# EAGLE schematic NSE2022 Electro_ESPtest ver.1 (EAGLE 9.6.2)
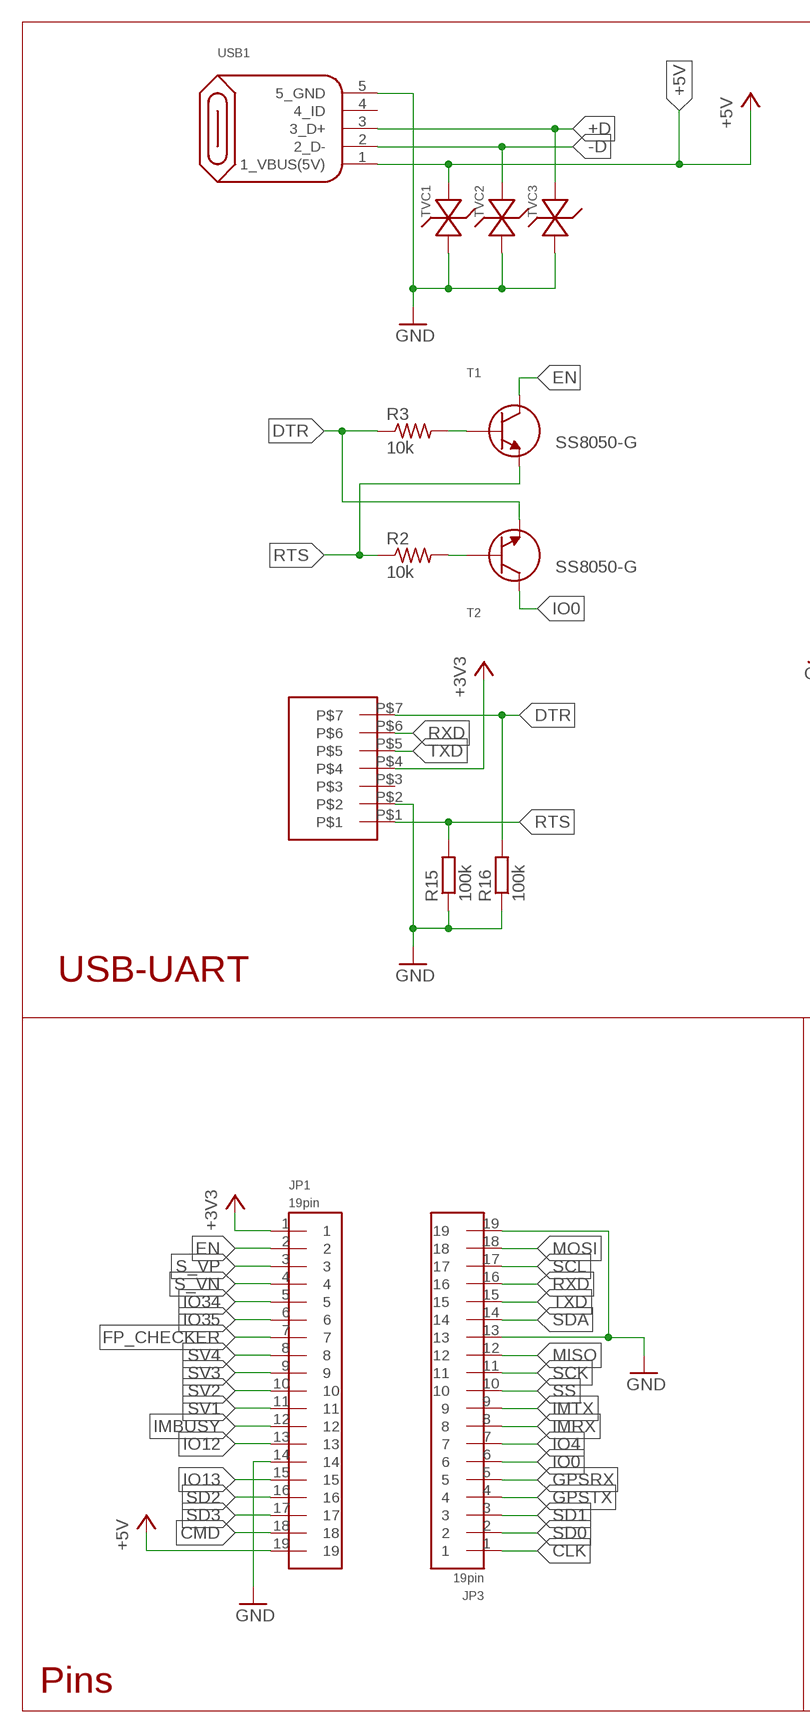
[diagram p0: schematic, sheet 1, part 1 of 2]
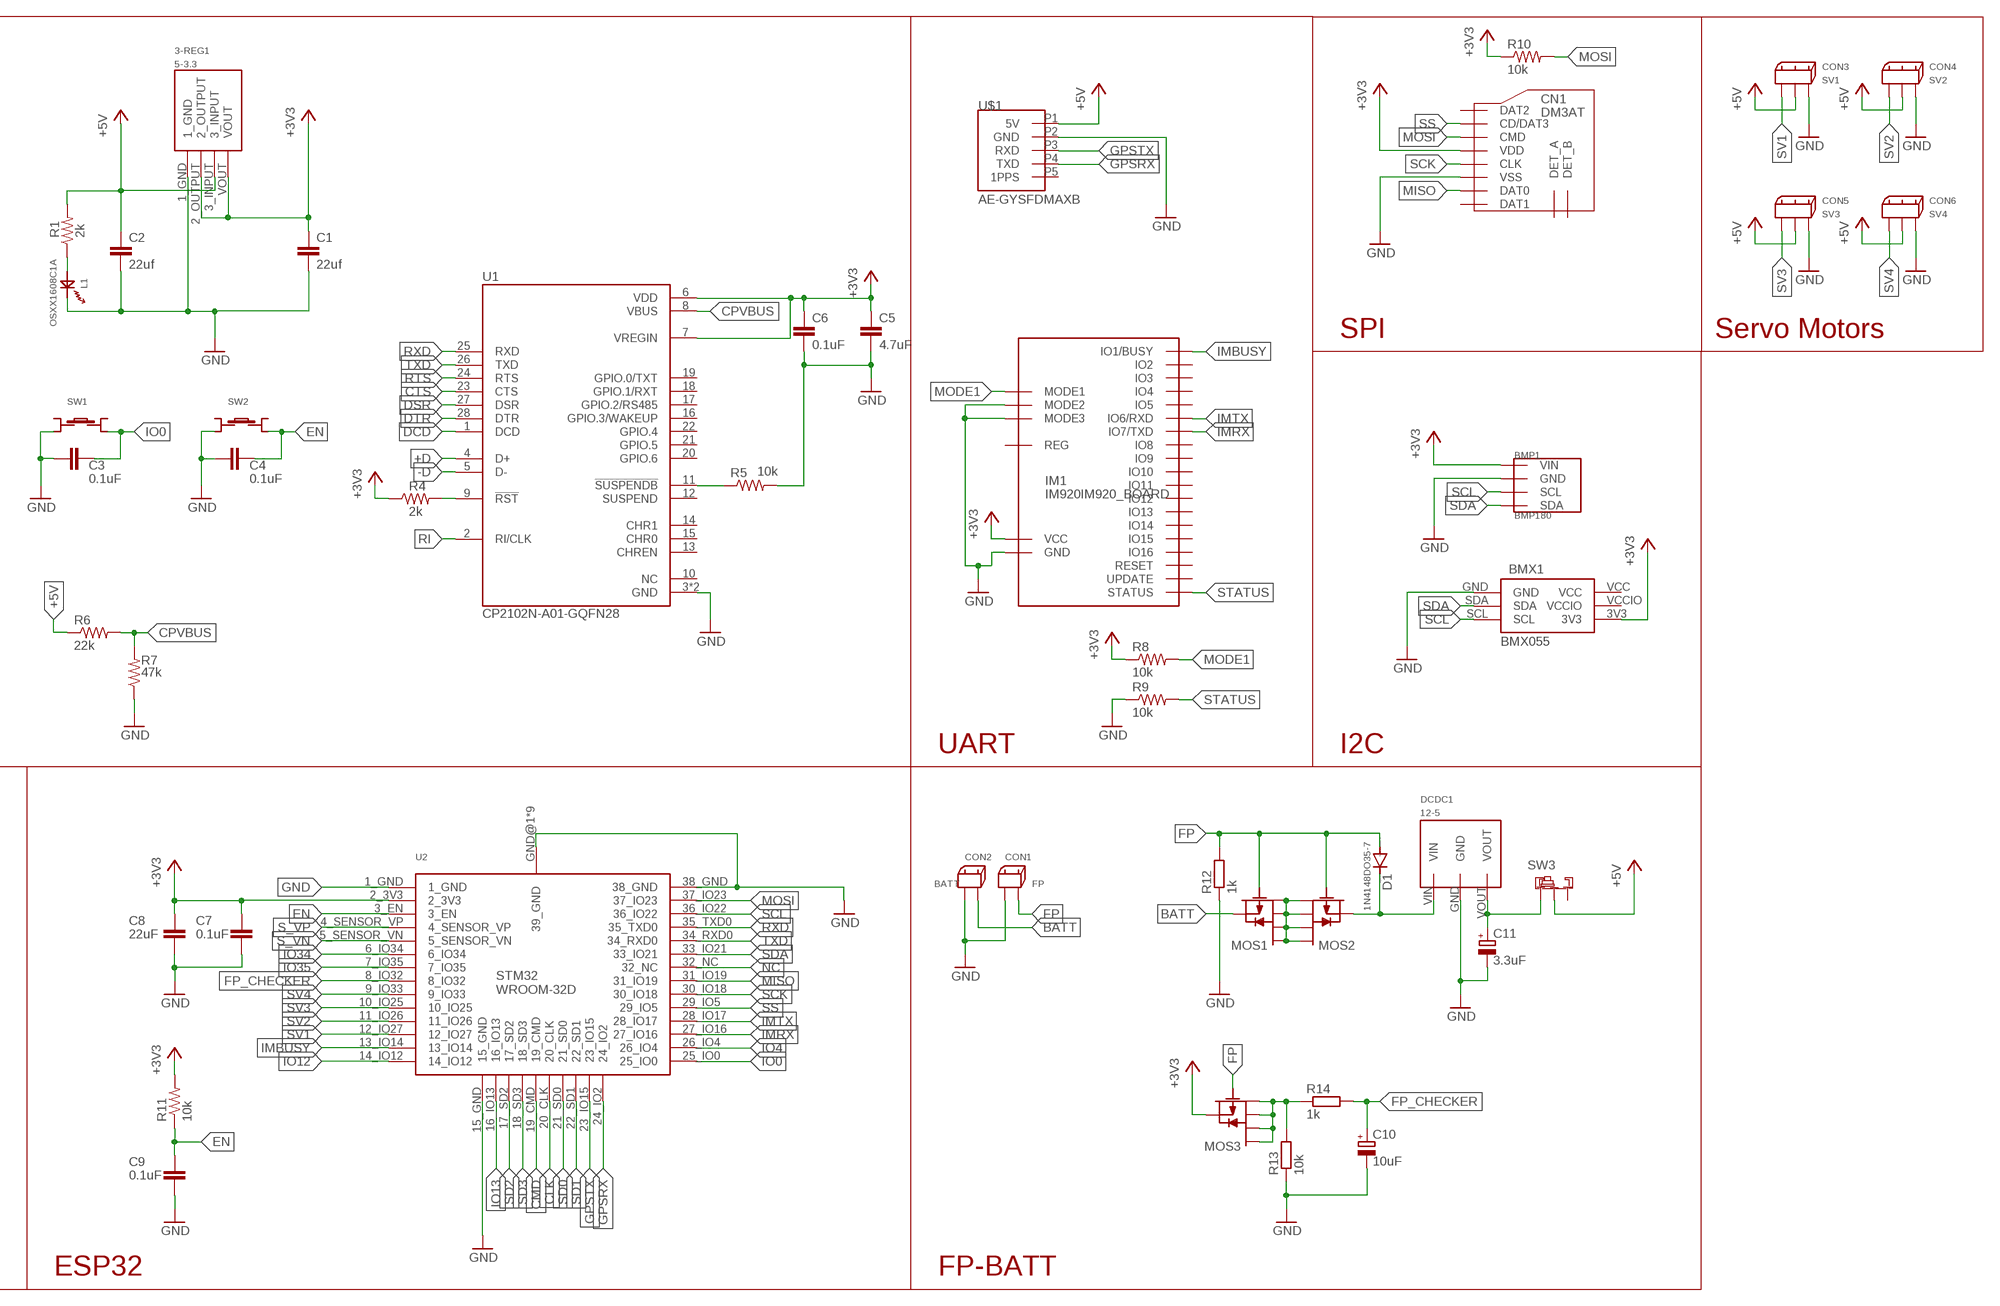
[diagram p1: schematic, sheet 1, part 2 of 2]

## Parts
3-REG1  5-3.3  AZ1117CH-3.3TRG1  [AZ1117CH-3.3TRG1]
BMP1  BMP180  [GY-68]
BMX1  BMX055  [BMX055]
C1  22uf  C-EUC0603  [C0603]
C2  22uf  C-EUC0603  [C0603]
C3  0.1uF  C-EUC0603  [C0603]
C4  0.1uF  C-EUC0603  [C0603]
C5  4.7uF  C-EUC0402  [C0402]
C6  0.1uF  C-EUC0603  [C0603]
C7  0.1uF  C-EUC0603  [C0603]
C8  22uF  C-EUC0603  [C0603]
C9  0.1uF  C-EUC0603  [C0603]
C10  10uF  CPOL-EUE2.5-5  [E2,5-5]
C11  3.3uF  CPOL-EUE2.5-5  [E2,5-5]
CN1  DM3AT  [DM3AT]
CON1  FP  2.5_MINI-SPOX_2PIN  [2.5_MINI-SPOX_2PIN]
CON2  BATT  2.5_MINI-SPOX_2PIN  [2.5_MINI-SPOX_2PIN]
CON3  SV1  2.5_MINI-SPOX_3PIN  [2.5_MINI-SPOX_3PIN]
CON4  SV2  2.5_MINI-SPOX_3PIN  [2.5_MINI-SPOX_3PIN]
CON5  SV3  2.5_MINI-SPOX_3PIN  [2.5_MINI-SPOX_3PIN]
CON6  SV4  2.5_MINI-SPOX_3PIN  [2.5_MINI-SPOX_3PIN]
D1  1N4148DO35-7  [DO35-7]
DCDC1  12-5  5V1A_M78AR05-1  [5V1A_M78AR05-1]
IM1  IM920IM920_BOARD  [IM920_BOARD]
JP1  19pin  19_2.54  [19_2.54]
JP2  7pin  7_2.54  [7_2.54]
JP3  19pin  19_2.54  [19_2.54]
L1  OSXX1608C1A  [OSXX1608C1A]
MOS1  PCH_SSM6J808R  [SSM6J808R]
MOS2  PCH_SSM6J808R  [SSM6J808R]
MOS3  PCH_SSM6J808R  [SSM6J808R]
R1  2k  R-US_R0201  [R0201]
R2  10k  R-US_R0201  [R0201]
R3  10k  R-US_R0201  [R0201]
R4  2k  R-US_R0201  [R0201]
R5  10k  R-US_R0201  [R0201]
R6  22k  R-US_R0201  [R0201]
R7  47k  R-US_R0201  [R0201]
R8  10k  R-US_R0201  [R0201]
R9  10k  R-US_R0201  [R0201]
R10  10k  R-US_R0201  [R0201]
R11  10k  R-US_R0201  [R0201]
R12  1k  R-EU_0207/10  [0207/10]
R13  10k  R-EU_0207/10  [0207/10]
R14  1k  R-EU_0207/10  [0207/10]
R15  100k  R-EU_0207/10  [0207/10]
R16  100k  R-EU_0207/10  [0207/10]
SW1  TS-06104  [TS-06104]
SW2  TS-06104  [TS-06104]
SW3  SRIDE_SWITCH  [SRIDE_SWITCH]
T1  NPN_SS8050-G  [NPN_SS8050-G]
T2  NPN_SS8050-G  [NPN_SS8050-G]
TVC1  ESD5484FCT5G  [ESD5484FCT5G]
TVC2  ESD5484FCT5G  [ESD5484FCT5G]
TVC3  ESD5484FCT5G  [ESD5484FCT5G]
U1  CP2102N-A01-GQFN28  [QFN50P500X500X80-29N]
U2  ESP32-WROOM-32D  [ESP32-WROOM-32D]
U$1  AE-GYSFDMAXB  [AE-GYSFDMAXB]
USB1  MICRO-B_ZX62R-B-5P  [MICRO-B_ZX62R-B-5P]

## Nets
+3V3 [esp]: 3-REG1.2_OUTPUT 3-REG1.VOUT BMP1.P1(VIN) BMX1.3V3 C1.1 C5.1 C6.1 C7.1 C8.1 CN1.VDD IM1.IO23(VCC) JP1.1 JP2.P$4 MOS3.S R4.1 R8.1 R10.1 R11.2 U1.6(VDD) U1.7(VREGIN) U2.2_3V3
+5V [esp]: 3-REG1.3_INPUT C2.1 CON3.2 CON4.2 CON5.2 CON6.2 JP1.19 R1.2 R6.1 SW3.LR TVC1.2_AN U$1.P1(5V) USB1.1(1_VBUS(5V))
+D [esp]: TVC3.2_AN U1.4(D+) USB1.3(3_D+)
-D [esp]: TVC2.2_AN U1.5(D-) USB1.2(2_D-)
BATT: CON2.2 MOS1.S
CLK [esp]: JP3.1 U2.20_CLK
CMD [esp]: JP1.18 U2.19_CMD
CPVBUS [esp]: R6.2 R7.2 U1.8(VBUS)
CTS [esp]: U1.23(CTS)
DCD [esp]: U1.1(DCD)
DSR [esp]: U1.27(DSR)
DTR [esp]: JP2.P$7 R3.1 R16.2 T2.2 U1.28(DTR)
EN [esp]: C4.1 C9.1 JP1.2 R11.1 SW2.D T1.3 U2.3_EN
FP: CON1.2 D1.A MOS1.G MOS2.G MOS3.G R12.2
FP_CHECKER: C10.+ JP1.7 R14.2 U2.8_IO32
GND [esp]: 3-REG1.1_GND BMP1.P2(GND) BMX1.GND C1.2 C2.2 C3.2 C4.2 C5.2 C6.2 C7.2 C8.2 C9.2 C10.- C11.- CN1.VSS CON1.1 CON2.1 CON3.3 CON4.3 CON5.3 CON6.3 DCDC1.GND IM1.IO18(MODE2) IM1.IO19(MODE3) IM1.IO24(GND) JP1.14 JP2.P$2 JP3.13 JP3.19 L1.CT R5.2 R7.1 R9.1 R12.1 R13.1 R15.1 R16.1 SW1.B SW2.B TVC1.1_CT TVC2.1_CT TVC3.1_CT U1.3(GND) U1.29(GND) U2.1_GND U2.15_GND U2.38_GND U2.GND@1(39_GND) U2.GND@2(39_GND) U2.GND@3(39_GND) U2.GND@4(39_GND) U2.GND@5(39_GND) U2.GND@6(39_GND) U2.GND@7(39_GND) U2.GND@8(39_GND) U2.GND@9(39_GND) U$1.P2(GND) USB1.5(5_GND)
GPSRX: JP3.5 U2.24_IO2 U$1.P4(TXD)
GPSTX: JP3.4 U2.23_IO15 U$1.P3(RXD)
IMBUSY: IM1.IO1(IO1/BUSY) JP1.12 U2.13_IO14
IMRX: IM1.IO7(IO7/TXD) JP3.8 U2.27_IO16
IMTX: IM1.IO6(IO6/RXD) JP3.9 U2.28_IO17
IO0 [esp]: C3.1 JP3.6 SW1.D T2.3 U2.25_IO0
IO4 [esp]: JP3.7 U2.26_IO4
IO12 [esp]: JP1.13 U2.14_IO12
IO13 [esp]: JP1.15 U2.16_IO13
IO34 [esp]: JP1.5 U2.6_IO34
IO35 [esp]: JP1.6 U2.7_IO35
MISO: CN1.DAT0 JP3.12 U2.31_IO19
MODE1: IM1.IO17(MODE1) R8.2
MOSI: CN1.CMD JP3.18 R10.2 U2.37_IO23
N$1 [esp]: L1.AN R1.1
N$2 [esp]: R3.2 T1.1
N$5 [esp]: R2.2 T2.1
N$8 [esp]: R4.2 U1.9(!RST)
N$10 [esp]: R5.1 U1.11(!SUSPENDB)
N$11: D1.C DCDC1.VIN MOS2.S
N$12: MOS1.D1 MOS1.D2 MOS1.D3 MOS1.D4 MOS2.D1 MOS2.D2 MOS2.D3 MOS2.D4
N$13: C11.+ DCDC1.VOUT SW3.L
N$14: MOS3.D1 MOS3.D2 MOS3.D3 MOS3.D4 R13.2 R14.1
NC [esp]: U2.32_NC
RI [esp]: U1.2(RI/CLK)
RTS [esp]: JP2.P$1 R2.1 R15.2 T1.2 U1.24(RTS)
RXD [esp]: JP2.P$6 JP3.16 U1.25(RXD) U2.35_TXD0
S_VN [esp]: JP1.4 U2.5_SENSOR_VN
S_VP [esp]: JP1.3 U2.4_SENSOR_VP
SCK: CN1.CLK JP3.11 U2.30_IO18
SCL: BMP1.P3(SCL) BMX1.SCL JP3.17 U2.36_IO22
SD0 [esp]: JP3.2 U2.21_SD0
SD1 [esp]: JP3.3 U2.22_SD1
SD2 [esp]: JP1.16 U2.17_SD2
SD3 [esp]: JP1.17 U2.18_SD3
SDA: BMP1.P4(SDA) BMX1.SDA JP3.14 U2.33_IO21
SS: CN1.CD/DAT3 JP3.10 U2.29_IO5
STATUS: IM1.IO21(STATUS) R9.2
SV1: CON3.1 JP1.11 U2.12_IO27
SV2: CON4.1 JP1.10 U2.11_IO26
SV3: CON5.1 JP1.9 U2.10_IO25
SV4: CON6.1 JP1.8 U2.9_IO33
TXD [esp]: JP2.P$5 JP3.15 U1.26(TXD) U2.34_RXD0
Unconnected: CN1.DAT1 CN1.DAT2 CN1.DET_A CN1.DET_B IM1.IO2 IM1.IO3 IM1.IO4 IM1.IO5 IM1.IO8 IM1.IO9 IM1.IO10 IM1.IO11 IM1.IO12 IM1.IO13 IM1.IO14 IM1.IO15 IM1.IO16 IM1.IO20(UPDATE) IM1.IO22(REG) IM1.IO25(RESET) JP2.P$3 SW1.A SW1.C SW2.A SW2.C SW3.R U1.10(NC) U1.12(SUSPEND) U1.13(CHREN) U1.14(CHR1) U1.15(CHR0) U1.16(GPIO.3/WAKEUP) U1.17(GPIO.2/RS485) U1.18(GPIO.1/RXT) U1.19(GPIO.0/TXT) U1.20(GPIO.6) U1.21(GPIO.5) U1.22(GPIO.4) U$1.P5(1PPS) USB1.4(4_ID)

## Notes on the sheet
- SS8050-G | SPI | Servo Motors
- SS8050-G
- USB-UART
- UART | I2C
- Pins | ESP32 | FP-BATT

## Power pins joined to a net without a drawn wire
VCC: BMX1.VCC
VCCIO: BMX1.VCCIO

## Library data of the parts
3-REG1 = Chip 3-Terminal Regulator:AZ1117CH-3.3TRG1
BMP1 = BMP180:BMP180
BMX1 = BMX055:BMX055
C1-C9 = rcl:C-EU: CAPACITOR, European symbol; SPICEPREFIX: C
C10 C11 = rcl:CPOL-EU: POLARIZED CAPACITOR, European symbol; SPICEPREFIX: C
CN1 = microSD:DM3AT
CON1 CON2 = Connector:2.5_MINI-SPOX_2PIN
CON3-CON6 = Connector:2.5_MINI-SPOX_3PIN
D1 = diode:1N4148: DIODE high speed (Philips)
DCDC1 = DC-DC:5V1A_M78AR05-1
IM1 = IM920:IM920
JP1 JP3 = JumperPins:19_2.54
JP2 = JumperPins:7_2.54
L1 = ChipLED:OSXX1608C1A
MOS1-MOS3 = Chip MOSFET:PCH_SSM6J808R
R1-R11 = rcl:R-US_: RESISTOR, American symbol; SPICEPREFIX: R
R12-R16 = rcl:R-EU_: RESISTOR, European symbol; SPICEPREFIX: R
SW1 SW2 = Switches:TS-06104
SW3 = Switches:SRIDE_SWITCH
T1 T2 = Chip Transister:NPN_SS8050-G
TVC1-TVC3 = TVC Diode:ESD5484FCT5G
U1 = CP2102N-A01-GQFN28:CP2102N-A01-GQFN28: USB Bridge, USB to UART USB 2.0 UART Interface 28-QFN (5x5) Check availability <https://pricing.snapeda.com/parts/CP2102N-A01-GQFN28/Silicon%20Labs/view-part?ref=eda>; AVAILABILITY: In Stock; DESCRIPTION: USB Bridge, USB to UART USB 2.0 UART Interface 28-QFN (5x5); MF: Silicon Labs; MP: CP2102N-A01-GQFN28; PACKAGE: QFN-28 Silicon Labs; PRICE: None; PURCHASE-URL: https://pricing.snapeda.com/search/part/CP2102N-A01-GQFN28/?ref=eda
U2 = ESP32:ESP32-WROOM-32D
U$1 = AE-GYSFDMAXB:AE-GYSFDMAXB
USB1 = USB:MICRO-B_ZX62R-B-5P

## Net classes
1 esp: width 0.254 mm, drill 0.127 mm, clearance 0.025 mm